# Altium project RM-KM-CS.PrjPcb
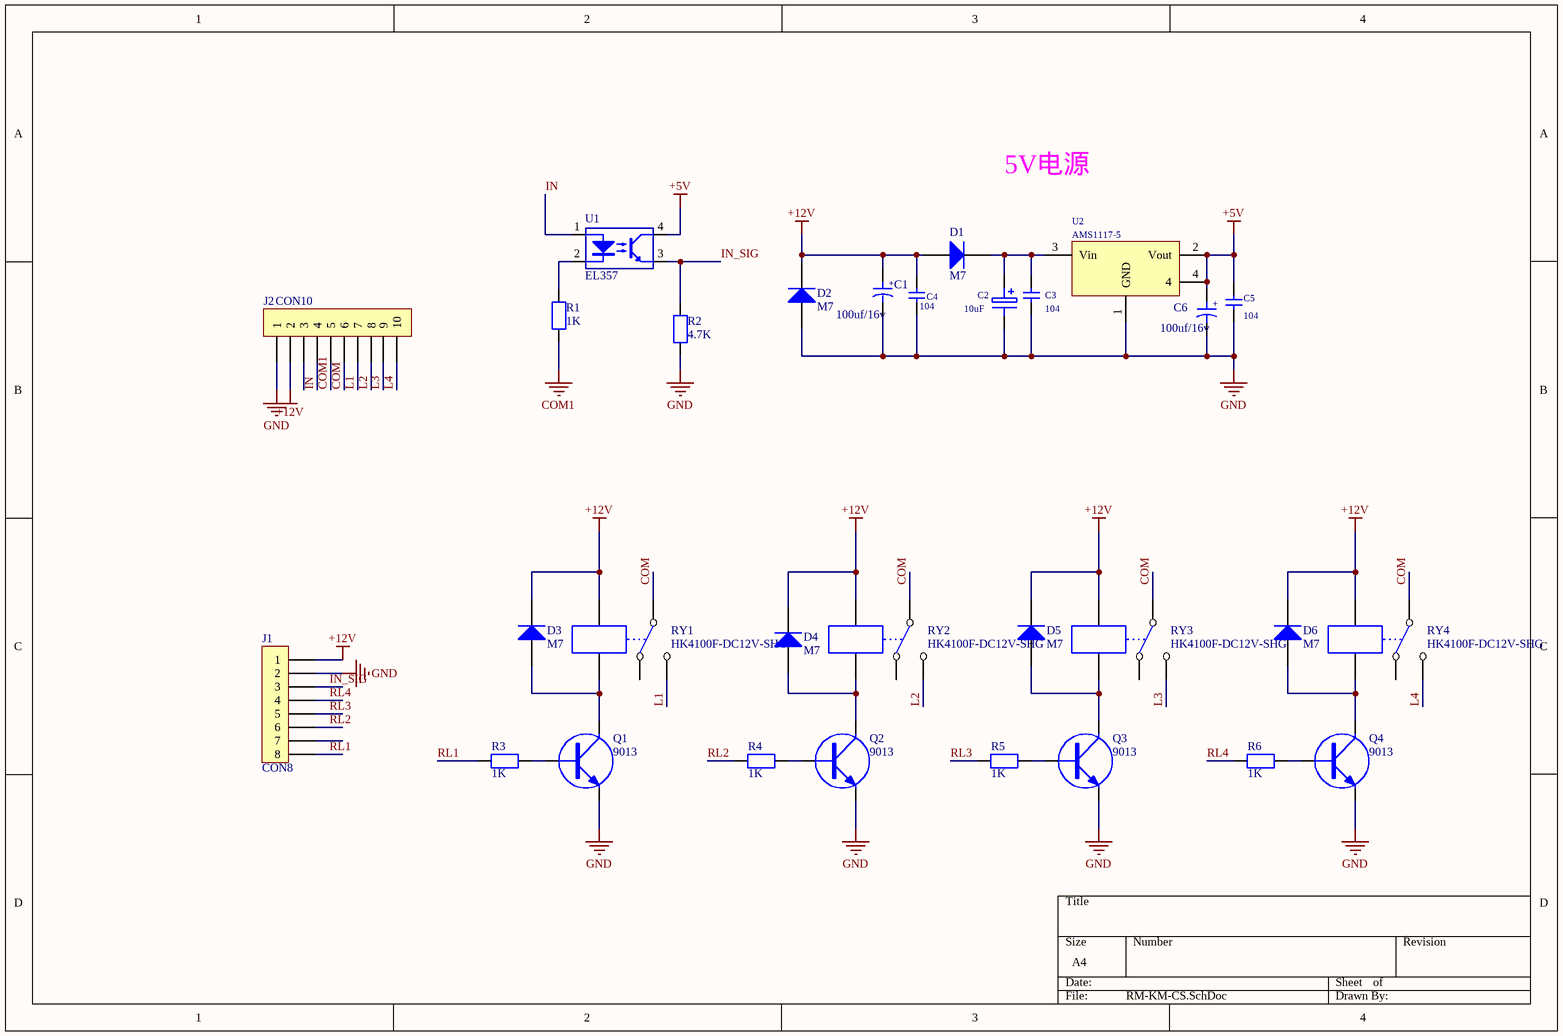
[diagram p0: RM-KM-CS.SchDoc]
1 sheet, 30 parts. Net scope: global (net labels, ports and power ports of the same name join across sheets).
Board file: RM-KM-CS  V1.0.PcbDoc

## Sheet RM-KM-CS.SchDoc
size A4

### Parts
C1  100uf/16v  [CAP-DIP4*7]
C2  10uF  [1206C]
C3  104  [0805C]
C4  104  [0805C]
C5  104  [0805C]
C6  100uf/16v  [CAP-DIP4*7]
D1  M7  [M7]
D2  M7  [M7]
D3  M7  [M7]
D4  M7  [M7]
D5  M7  [M7]
D6  M7  [M7]
J1  CON8  [DIP-8P-2.0 -1]
J2  CON10  [SPI-10P-5.0_S]
Q1  9013  [SOT-23]
Q2  9013  [SOT-23]
Q3  9013  [SOT-23]
Q4  9013  [SOT-23]
R1  1K  [0805R]
R2  4.7K  [0805R]
R3  1K  [0805R]
R4  1K  [0805R]
R5  1K  [0805R]
R6  1K  [0805R]
RY1  HK4100F-DC12V-SHG  [RELAY]
RY2  HK4100F-DC12V-SHG  [RELAY]
RY3  HK4100F-DC12V-SHG  [RELAY]
RY4  HK4100F-DC12V-SHG  [RELAY]
U1  EL357  [EL357]
U2  AMS1117-5  [SOT-223]

### Nets
+5V: C5.1 C6.1 U1.4(Collector) U2.2(Vout) U2.4
+12V: C1.1 C4.1 D1.A D2.K D3.K D4.K D5.K D6.K J1.1 J2.2 RY1.2 RY2.2 RY3.2 RY4.2
COM1: J2.5 R1.1
GND: C1.2 C2.2 C3.2 C4.2 C5.2 C6.2 D2.A J1.2 J2.1 Q1.2 Q2.2 Q3.2 Q4.2 R2.1 U2.1(GND)
COM: J2.6 RY1.1 RY2.1 RY3.1 RY4.1
IN: J2.4 U1.1(LED_Anode)
IN_SIG: J1.3 R2.2 U1.3(Emitter)
L1: J2.7 RY1.4
L2: J2.8 RY2.4
L3: J2.9 RY3.4
L4: J2.10 RY4.4
RL1: J1.8 R3.2
RL2: J1.6 R4.2
RL3: J1.5 R5.2
RL4: J1.4 R6.2
NetC2_1: C2.1 C3.1 D1.K U2.3(Vin)
NetD3_A: D3.A Q1.3 RY1.5
NetD4_A: D4.A Q2.3 RY2.5
NetD5_A: D5.A Q3.3 RY3.5
NetD6_A: D6.A Q4.3 RY4.5
NetQ1_1: Q1.1 R3.1
NetQ2_1: Q2.1 R4.1
NetQ3_1: Q3.1 R5.1
NetQ4_1: Q4.1 R6.1
NetR1_2: R1.2 U1.2(LED_Cathode)

Not connected (* = marked no-connect by the designer): J1 7; J2 3; RY1 3; RY2 3; RY3 3; RY4 3

### Notes on the sheet
- 5V电源
- (in symbol ECAP) +

### Library data of the parts
C1 C6 = ECAP
C2 = ELECTRO1: Electrolytic Capacitor
C3-C5 = CAP
R1-R6 = RES
RY1-RY4 = RELAY5V
U1 = 817
U2 = VOL